# EAGLE design icyradio-lna (EAGLE 9.6.1)
CNAME: None; CREVISION: 1; DESIGNER: Joao Silva
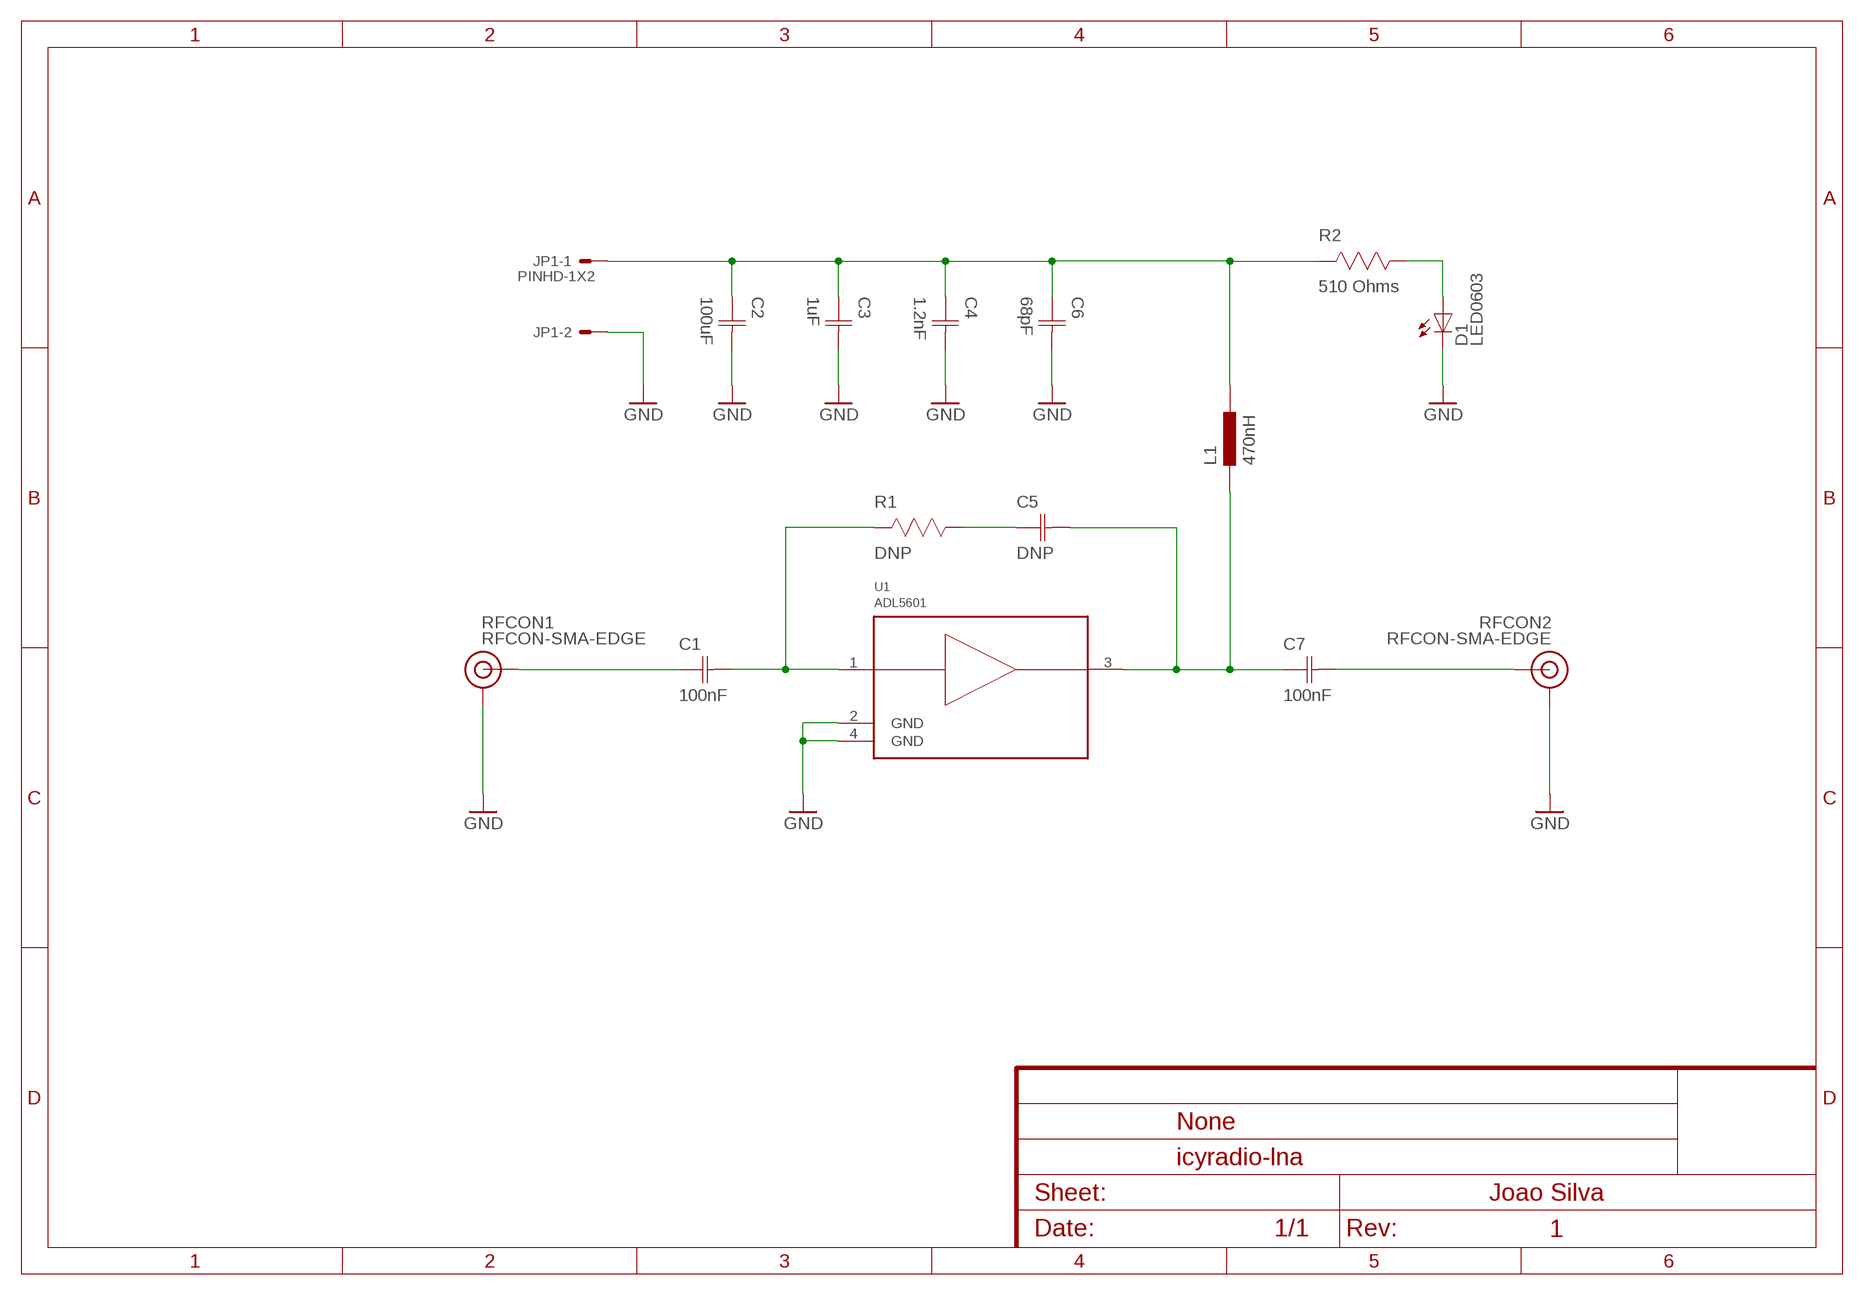
[diagram p0: schematic, sheet 1]

## Parts
C1  100nF  CAPACITOR-0603  [CAP0603]
C2  100uF  CAPACITOR-1206  [CAP1206]
C3  1uF  CAPACITOR-0603  [CAP0603]
C4  1.2nF  CAPACITOR-0603  [CAP0603]
C5  DNP  CAPACITOR-0603  [CAP0603]
C6  68pF  CAPACITOR-0603  [CAP0603]
C7  100nF  CAPACITOR-0603  [CAP0603]
D1  LED0603  [0603]
JP1  PINHD-1X2  [1X02]
L1  470nH  INDUCTOR-0603  [IND0603]
R1  DNP  RESISTOR-0603  [RES0603]
R2  510 Ohms  RESISTOR-0603  [RES0603]
RFCON1  RFCON-SMA-EDGE  [SMA-EDGE]
RFCON2  RFCON-SMA-EDGE  [SMA-EDGE]
U1  ADL5601  [SOT89]

## Nets
GND: C2.2(C2) C3.2(C2) C4.2(C2) C6.2(C2) D1.C JP1.2 RFCON1.GND@0(GND) RFCON1.GND@1(GND) RFCON1.GND@2(GND) RFCON1.GND@3(GND) RFCON2.GND@0(GND) RFCON2.GND@1(GND) RFCON2.GND@2(GND) RFCON2.GND@3(GND) U1.2(GND) U1.4(GND)
N$92: C5.1(C1) R1.1
N$146: D1.A R2.1
RFIN: C1.1(C1) RFCON1.SIG(SIGNAL)
RFOUT: C7.2(C2) RFCON2.SIG(SIGNAL)
TXPA_IN: C1.2(C2) R1.2 U1.1(RFIN)
TXPA_OUT: C5.2(C2) C7.1(C1) L1.1 U1.3(RFOUT)
VDD: C2.1(C1) C3.1(C1) C4.1(C1) C6.1(C1) JP1.1 L1.2 R2.2

## Library data of the parts
C1-C7 = Capacitor:CAPACITOR
D1 = LED:LED
JP1 = Pin Header:PINHD-1X2: PIN HEADER
L1 = Inductor:INDUCTOR
R1 R2 = Resistor:RESISTOR
RFCON1 RFCON2 = RF Connector:RFCON
U1 = Analog Devices:ADL5?

## Board
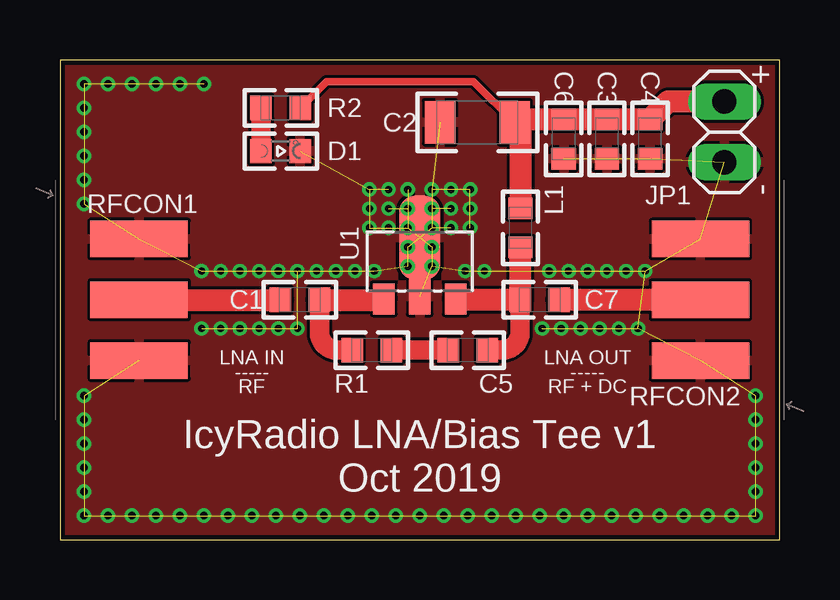
[diagram p1: board, top side]
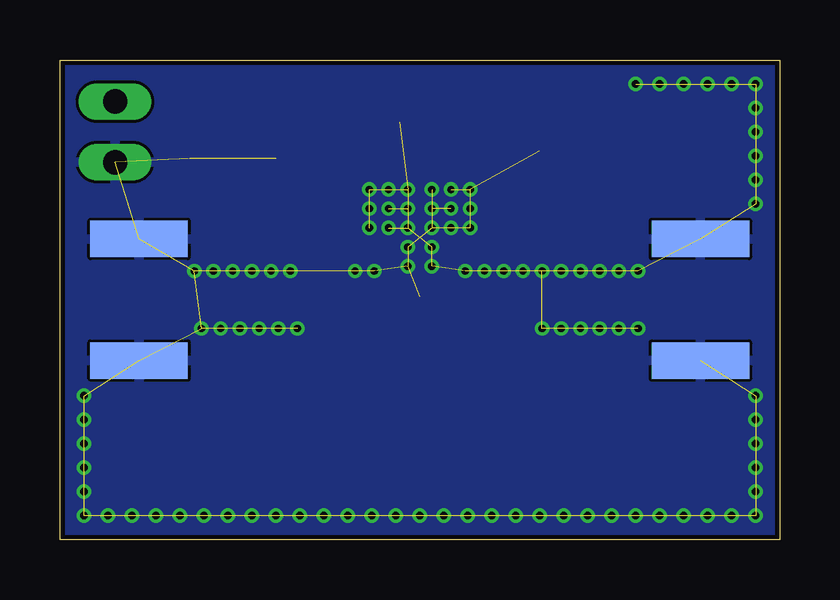
[diagram p2: board, bottom side, seen from below]

Size 30 x 20 mm. Coordinates in mm from the lower left corner, seen from the top.
Outline: 0,0 30,0 30,20 0,20 0,0
Copper layers (1*16): Top 0.035mm / dielectric 1.6mm / Bottom 0.035mm
Design rules "jlcpcb_2layer": minimum track width 5mil, minimum drill 0.3mm, track to track 5mil, track to pad 5mil, pad to pad 5mil, via to via 5mil, smd to smd 5mil, copper to edge 0.2mm, drill to drill 5mil, minimum pad ring 3mil, minimum via ring 3mil, stop-mask expansion 0.075mm, vias tented up to drill 10mm, thermal gap 5mil

### Footprints (pad centres in the part's own frame; a part is rotated, then mirrored left to right if it is on the bottom)
CAP0603 = smd 0.889 x 1.016: 1 -0.819,0; 2 0.819,0
CAP1206 = smd 1.27 x 1.778: 1 -1.549,0; 2 1.549,0
0603 = smd 0.889 x 1.016: A 0.819,0; C -0.819,0
1X02 = drill 1.016 long: 1 -1.27,0; 2 1.27,0
IND0603 = smd 0.889 x 1.016: 1 -0.819,0; 2 0.819,0
RES0603 = smd 0.889 x 1.016: 1 -0.819,0; 2 0.819,0
SMA-EDGE = smd 1.524 x 4.064: GND@0 -2.54,0; GND@1 2.54,0; SIG 0,0 | smd 1.524 x 4.064 bottom: GND@2 -2.54,0; GND@3 2.54,0
SOT89 = smd 0.9 x 1.3: 1 -1.5,-1.562; 3 1.5,-1.562 | smd 0.9 x 1.5: 2 0,-1.462 | smd 1.733 x 3.5: 4 0,0.988

### Placement (x,y rotation side)
C1  10,10 0 top
C2  17.4,17.4 180 top
C3  22.8,16.7 270 top
C4  24.6,16.7 270 top
C5  17,7.9 0 top
C6  21,16.7 270 top
C7  20,10 0 top
D1  9.2,16.2 180 top
JP1  27.7,17 270 top
L1  19.2,13 90 top
R1  13,7.9 180 top
R2  9.2,18 0 top
RFCON1  3.3,10 270 top
RFCON2  26.7,10 90 top
U1  15,11.6 0 top

### Tracks (layer width: path | path; a pad name or v marks a point on that pad's centre or on a via)
GND  (via drill 0.3)  (117 unrouted)
  other vias: 5.9,8.8 9.9,8.8 9.1,8.8 7.5,8.8 6.7,8.8 8.3,8.8 15.5,13 15.5,13.8 14.5,13.8 14.5,13 14.5,12.2 14.5,11.4 15.5,11.4 15.5,12.2 13.1,11.2 12.3,11.2 11.5,11.2 10.7,11.2 5.9,11.2 9.9,11.2 9.1,11.2 7.5,11.2 6.7,11.2 8.3,11.2 24.4,11.2 23.6,11.2 22.8,11.2 22,11.2 21.2,11.2 20.4,11.2 16.9,11.2 17.7,11.2 20.1,8.8 24.1,8.8 23.3,8.8 21.7,8.8 20.9,8.8 22.5,8.8 1,1 2,1 3,1 4,1 5,1 6,1 25,1 26,1 27,1 28,1 29,1 19,1 20,1 21,1 22,1 23,1 24,1 13,1 14,1 15,1 16,1 17,1 18,1 7,1 8,1 9,1 10,1 11,1 12,1 1,3 1,4 1,5 1,6 1,2 29,3 29,4 29,5 29,6 29,2 1,19 1,18 1,17 1,16 1,15 1,14 3,19 4,19 5,19 6,19 2,19 12.9,14.6 12.9,13.8 12.9,13 13.7,13 13.7,13.8 13.7,14.6 14.5,14.6 15.5,14.6 16.3,14.6 17.1,14.6 17.1,13.8 17.1,13 16.3,13 16.3,13.8
  pour Top: -1,21 31,21 31,-1 -1,-1
  pour Bottom: -2,22 32,22 32,-2 -2,-2
N$92
  Top 0.813: R1.1 C5.1
N$146
  Top 0.813: D1.A R2.1
RFIN
  Top 0.91: RFCON1.SIG C1.1
RFOUT
  Top 0.91: RFCON2.SIG C7.2
TXPA_IN
  Top 0.813: R1.2 11.57,7.9 arc-90 10.82,8.65 C1.2
  Top 0.91: C1.2 13.46,10 U1.1
TXPA_OUT
  Top 0.813: C5.2 18.43,7.9 arc90 19.18,8.65 C7.1
  Top 0.91: U1.3 16.54,10 C7.1 19.18,12.16 L1.1
VDD
  Top 0.305: R2.2 11.12,19.1 17.25,19.1 C2.1
  Top 0.91: L1.2 19.2,17.15 C2.1 19.07,17.52 C6.1 C3.1 C4.1 25.35,18.27 JP1.1

### Text on the board
tPlace: + | - | LNA IN / ----- / RF | LNA OUT / ----- / RF + DC | IcyRadio LNA/Bias Tee v1 / Oct 2019